# Altium schematic sheet Sheet1.SchDoc
size A4
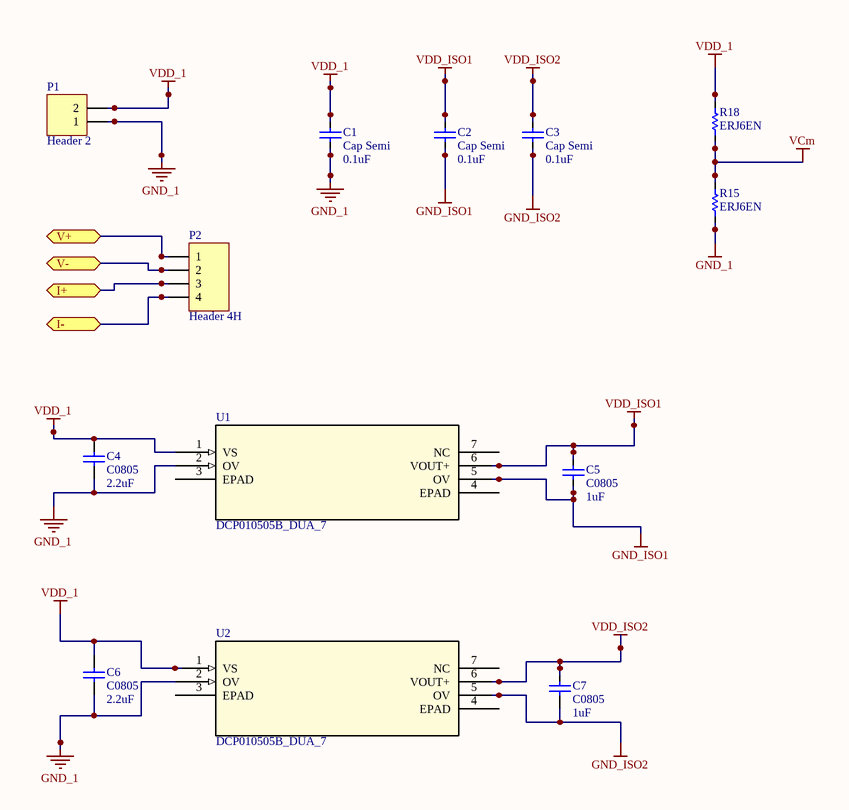
[diagram p0: Sheet1.SchDoc]

## Parts
C1  Cap Semi  value 0.1uF  [C1206]
C2  Cap Semi  value 0.1uF  [C1206]
C3  Cap Semi  value 0.1uF  [C1206]
C4  C0805  value 2.2uF  [0805]
C5  C0805  value 1uF  [0805]
C6  C0805  value 2.2uF  [0805]
C7  C0805  value 1uF  [0805]
P1  Header 2  [HDR1X2]
P2  Header 4H  [HDR1X4H]
R15  ERJ6EN  [6-0805]
R18  ERJ6EN  [6-0805]
U1  DCP010505B_DUA_7  [DUA7]
U2  DCP010505B_DUA_7  [DUA7]

## Ports
I+, I-, V+, V-

## Nets
GND_1: C1.1 C4.1 C6.1 P1.1 R15.1 U1.2(OV) U2.2(OV)
GND_ISO1: C2.1 C5.1 U1.5(OV)
GND_ISO2: C3.1 C7.1 U2.5(OV)
VCm: R15.2 R18.1
VDD_1: C1.2 C4.2 C6.2 P1.2 R18.2 U1.1(VS) U2.1(VS)
VDD_ISO1: C2.2 C5.2 U1.6(VOUT+)
VDD_ISO2: C3.2 C7.2 U2.6(VOUT+)
I+: P2.3 ; port I+
I-: P2.4 ; port I-
V+: P2.1 ; port V+
V-: P2.2 ; port V-

Not connected (* = marked no-connect by the designer): U1 3(EPAD) 4(EPAD) 7(NC); U2 3(EPAD) 4(EPAD) 7(NC)

## Library data of the parts
C1-C3 = Cap Semi: Capacitor (Semiconductor SIM Model); Published: 8-Jun-2000; LatestRevisionDate: 29-May-2009; LatestRevisionNote: IPC-7351 Footprint Added.; PackageReference: C1206; Publisher: Altium Limited; PackageDescription: Chip Capacitor
C4-C7 = C0805: Ceramic Chip Capacitor - Standard; Note: Footprint corresponds to dimensions for bulk cassette packaging. This case size has tightened tolerances.; Published: 17-Jul-2002; LatestRevisionDate: 19-Mar-2004; LatestRevisionNote: Silkscreen size reduced.; DatasheetDocument: Mar-2001; PackageDocument: Mar-2001; PackageReference: 0805; Publisher: Altium Limited; Code_JEITA: 0805; Code_IPC: 2012[0805]; ComponentLink1Description: Manufacturer Link; ComponentLink1URL: http://www.kemet.com/; ComponentLink2Description: Datasheet; ComponentLink2URL: http://www.kemet.com/kemet/web/homepage/kechome.nsf/vapubfilesname/F3102TA.pdf/$file/F3102TA.pdf
P1 = Header 2: Header, 2-Pin; LatestRevisionDate: 17-Jul-2002; LatestRevisionNote: Re-released for DXP Platform.; Publisher: Altium Limited
P2 = Header 4H: Header, 4-Pin, Right Angle; LatestRevisionDate: 17-Jul-2002; LatestRevisionNote: Re-released for DXP Platform.; Publisher: Altium Limited
R15 R18 = ERJ6EN: Precision Thick Film Chip Resistor, 10 Ohm to 2.2M Ohm Range, 1% Tolerance, 0805 Size, 0.1 W; Published: 17-Dec-2003; LatestRevisionDate: 19-Mar-2004; LatestRevisionNote: Silkscreen size reduced.; PackageDocument: Mar-2003; PackageReference: 6-0805; Publisher: Altium Limited; Code_IPC: 2012 [0805]; ComponentLink1Description: Manufacturer Link; ComponentLink1URL: http://www.panasonic.com/industrial/components/resistive_products.htm; ComponentLink2Description: Datasheet; ComponentLink2URL: http://www.panasonic.com/industrial/components/pdf/AOA0000CE2.pdf
U1 U2 = DCP010505B_DUA_7: Imported; Manufacturer: Texas Instruments; INDUSTRY_STD_PKG_TYPE: SOP; FAMILY_NAME: 1 W AND 2 W MINIATURE; PIN_COUNT: 7; PACKAGE_DESIGNATOR: DUA; Datasheet_URL: http://www.ti.com/lit/gpn/DCP010505B; GENERIC_PART_NUMBER: DCP010505B; Value: Value; Type: Type; RefDes: RefDes